# Altium schematic sheet GPS.SchDoc
size A4
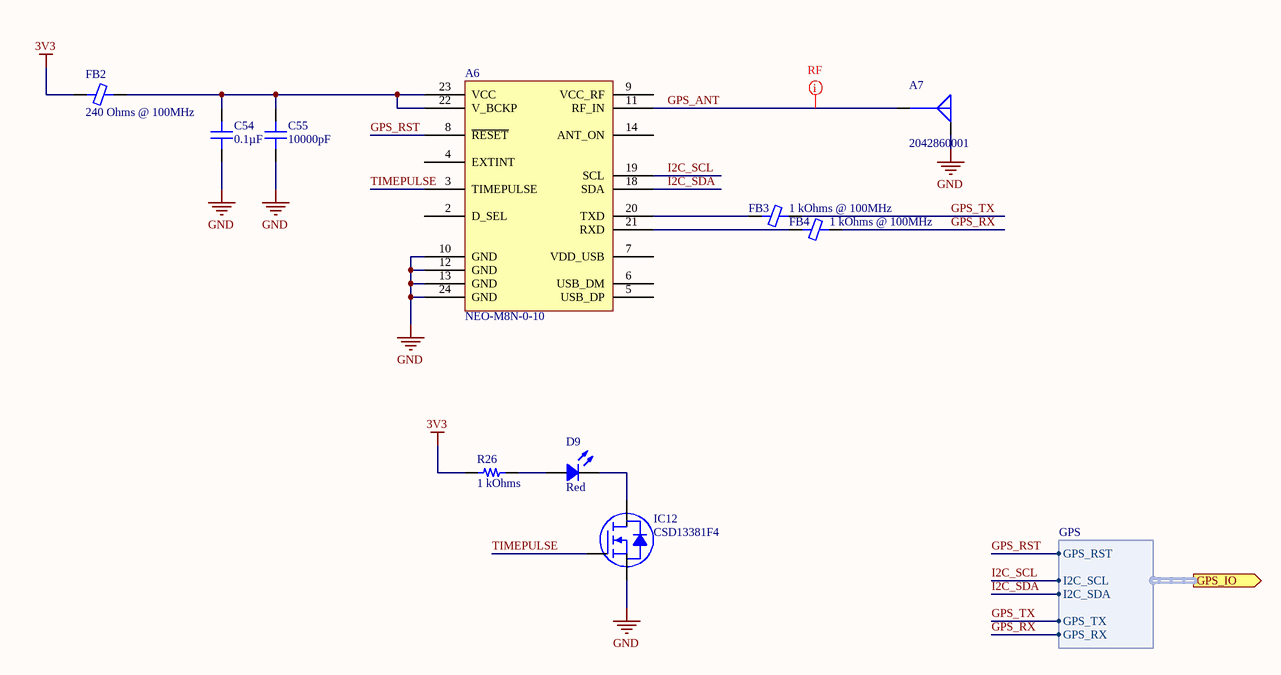
[diagram p0: GPS.SchDoc]

## Parts
A6  NEO-M8N-0-10  [U-BLOX NEO-M8N]
A7  2042860001  [MOLEX 2042860001]
C54  0.1µF  [CAP 0201_0603]
C55  10000pF  [CAP 0201_0603]
D9  Red  [LED 0402_1005 RED]
FB2  240 Ohms @ 100MHz  [FER 0201_0603]
FB3  1 kOhms @ 100MHz  [FER 0201_0603]
FB4  1 kOhms @ 100MHz  [FER 0201_0603]
IC12  CSD13381F4  [TI 3-XFDFN F4 YJC]
R26  1 kOhms  [RES 0201_0603]

## Ports
GPS_IO (out, harness GPS)

## Harnesses
GPS: I2C_SCL, I2C_SDA, GPS_TX, GPS_RX, GPS_RST

## Nets
3V3: FB2.1 R26.1
GND: A6.10(GND) A6.12(GND) A6.13(GND) A6.24(GND) A7.G C54.1 C55.1 IC12.S
GPS_ANT: A6.11(RF_IN) A7.S
GPS_RST: A6.8(~{RESET}) ; port GPS_IO.GPS_RST
GPS_RX: FB4.2 ; port GPS_IO.GPS_RX
GPS_TX: FB3.2 ; port GPS_IO.GPS_TX
I2C_SCL: A6.19(SCL) ; port GPS_IO.I2C_SCL
I2C_SDA: A6.18(SDA) ; port GPS_IO.I2C_SDA
TIMEPULSE: A6.3(TIMEPULSE) IC12.G
NetA6_20: A6.20(TXD) FB3.1
NetA6_21: A6.21(RXD) FB4.1
NetA6_22: A6.22(V_BCKP) A6.23(VCC) C54.2 C55.2 FB2.2
NetD9_1: D9.1 R26.2
NetD9_2: D9.2 IC12.D

Not connected (* = marked no-connect by the designer): A6 2(D_SEL) 4(EXTINT) 5(USB_DP) 6(USB_DM) 7(VDD_USB) 9(VCC_RF) 14(ANT_ON)

## Layout directives
net class RF: GPS_ANT

## Notes on the sheet
- Title
- Size:
- Date:
- A4
- Number:
- Time:
- Revision:
- Sheet
- of
- File:

## Library data of the parts
A6 = NEO-M8N-0-10: RF RCVR GNSS/GPS 1.575GHZ 24LCC; Manufacturer: U-Blox America Inc.; Current - Receiving: 21mA; Data Interface: I2C, SPI, UART, USB; Modulation or Protocol: BeiDou, Galileo, GLONASS, GNSS, GPS; Sensitivity: -167dBm; Voltage - Supply: 1.65V ~ 3.6V; Part Number: NEO-M8N-0-10; Applications: General Purpose; ComponentLink1Description: Datasheet; ComponentLink1URL: https://www.u-blox.com/sites/default/files/NEO-M8-FW3_DataSheet_%28UBX-15031086%29.pdf; ComponentLink2Description: DigiKey Link; ComponentLink2URL: http://digikey.com/product-detail/en/u-blox-america-inc/NEO-M8N-0-10/672-NEO-M8N-0-10CT-ND/6150671; Device Package: 24-SMD Module; Frequency: 1.575GHz; LastUpdated: 04/01/2020 00:19:34; Lifecycle Status: Active; Minimum Order: 1; Operating Temperature: -40°C ~ 85°C; Package / Case: 24-SMD Module; Packaging: ReReel; PartId: 3; Part Status: Active; Price: 0.00; Series: NEO-M8; Supplier 1: DigiKey; Supplier Part Number 1: 672-NEO-M8N-0-10CT-ND
A7 = 2042860001: RF ANT CER PATCH SOLDER SMD; Manufacturer: Molex; Antenna Type: Ceramic Patch; Frequency Group: UHF (1GHz ~ 2GHz); Gain: 5.5dBi; Number of Bands: 1; Return Loss: -10dB; RF Family/Standard: Navigation; Part Number: 2042860001; Applications: Beidou, GLONASS, GPS; ComponentLink1Description: Datasheet; ComponentLink1URL: http://www.literature.molex.com/SQLImages/kelmscott/Molex/PDF_Images/987651-5071.pdf; ComponentLink2Description: DigiKey Link; ComponentLink2URL: http://digikey.com/product-detail/en/molex/2042860001/WM16802-ND/7566910; Height (Max): 0.157" (4.00mm); LastUpdated: 12/12/2019 06:31:41; Lifecycle Status: 0; Minimum Order: 1; Mounting Type: Through Hole; Packaging: Tray; Part Status: Active; Price: 2.23; Series: *; Supplier 1: DigiKey; Supplier Part Number 1: WM16802-ND; Termination: Solder
C54 = GRM033R61C104ME84D: CAP CER 0.1UF 16V X5R 0201; Manufacturer: Murata Electronics; Tolerance: ±20%; Part Number: GRM033R61C104ME84D; Value: 0.1µF; Applications: General Purpose; Capacitance: 0.1µF; ComponentLink1Description: Datasheet; ComponentLink1URL: https://search.murata.co.jp/Ceramy/image/img/A01X/G101/ENG/GRM033R61C104ME84-01.pdf; ComponentLink2Description: DigiKey Link; ComponentLink2URL: http://digikey.com/product-detail/en/murata-electronics/GRM033R61C104ME84D/490-9986-1-ND/5026291; Device Package: 0201 (0603 Metric); LastUpdated: 21/01/2020 00:00:12; Lifecycle Status: Active; Minimum Order: 1; Mounting Type: Surface Mount, MLCC; Operating Temperature: -55°C ~ 85°C; Package / Case: 0201 (0603 Metric); Packaging: TapeAndReel; PartId: 1522; Part Status: Active; Price: 0.01; Series: GRM; Size / Dimension: 0.024" L x 0.012" W (0.60mm x 0.30mm); Supplier 1: DigiKey; Supplier Part Number 1: 490-9986-1-ND; Temperature Coefficient: X5R; Thickness (Max): 0.013" (0.33mm); Voltage - Rated: 16V
C55 = CGA1A2X7R0J103M030BA: CAP CER 10000PF 6.3V X7R 0201; Manufacturer: TDK Corporation; Tolerance: ±20%; Part Number: CGA1A2X7R0J103M030BA; Value: 10000pF; Applications: Automotive; Capacitance: 10000pF; ComponentLink1Description: Datasheet; ComponentLink1URL: https://product.tdk.com/info/en/catalog/datasheets/mlcc_automotive_general_en.pdf?ref_disty=digikey; ComponentLink2Description: DigiKey Link; ComponentLink2URL: http://digikey.com/product-detail/en/tdk-corporation/CGA1A2X7R0J103M030BA/445-12116-1-ND/3953782; Device Package: 0201 (0603 Metric); LastUpdated: 21/01/2020 00:00:11; Lifecycle Status: Active; Minimum Order: 1; Mounting Type: Surface Mount, MLCC; Operating Temperature: -55°C ~ 125°C; Package / Case: 0201 (0603 Metric); Packaging: TapeAndReel; PartId: 1683; Part Status: Active; Price: 0.01; Ratings: AEC-Q200; Series: CGA; Size / Dimension: 0.024" L x 0.012" W (0.60mm x 0.30mm); Supplier 1: DigiKey; Supplier Part Number 1: 445-12116-1-ND; Temperature Coefficient: X7R; Thickness (Max): 0.013" (0.33mm); Voltage - Rated: 6.3V
D9 = IN-S42ATR: LED RED CLEAR 0402 SMD; Manufacturer: Inolux; Configuration: Standard; Current - Test: 20mA; Lens Size: 0.60mm x 0.45mm; Lens Style: Rectangle with Flat Top; Millicandela Rating: 90mcd; Viewing Angle: 130°; Voltage - Forward (Vf) (Typ): 2.1V; Wavelength - Dominant: 631nm; Wavelength - Peak: 645nm; Part Number: IN-S42ATR; Color: Red; ComponentLink1Description: Datasheet; ComponentLink1URL: http://www.inolux-corp.com/datasheet/SMDLED/Mono%20Color%20Top%20View/IN-S42AT%20Series_V1.1.pdf; ComponentLink2Description: DigiKey Link; ComponentLink2URL: http://digikey.com/product-detail/en/inolux/IN-S42ATR/1830-1057-1-ND/7604692; Device Package: 0402 (1005 Metric); Height (Max): 0.55mm; LastUpdated: 21/01/2020 03:12:45; Lens Color: Clear; Lens Transparency: Clear; Lifecycle Status: Active; Minimum Order: 1; Mounting Type: Surface Mount; Package / Case: 0402 (1005 Metric); Packaging: TapeAndReel; PartId: 504; Part Status: Active; Price: 0.06; Series: IN-S42AT; Size / Dimension: 1.00mm L x 0.50mm W; Supplier 1: DigiKey; Supplier Part Number 1: 1830-1057-1-ND; Supplier Device Package: 0402; Value: Red
FB2 = BK0603TS241-T: FERRITE BEAD 240 OHM 0201 1LN; Manufacturer: Taiyo Yuden; Current Rating (Max): 400mA; DC Resistance (DCR) (Max): 320mOhm; Number of Lines: 1; Part Number: BK0603TS241-T; ComponentLink1Description: Datasheet; ComponentLink1URL: https://ds.yuden.co.jp/TYCOMPAS/ut/detail?pn=BK0603TS241-T  &u=M; ComponentLink2Description: DigiKey Link; ComponentLink2URL: http://digikey.com/product-detail/en/taiyo-yuden/BK0603TS241-T/587-3276-1-ND/4157923; Device Package: 0201 (0603 Metric); Height (Max): 0.013" (0.33mm); Impedance @ Frequency: 240 Ohms @ 100MHz; LastUpdated: 21/01/2020 02:24:59; Lifecycle Status: Active; Minimum Order: 1; Mounting Type: Surface Mount; Operating Temperature: -55°C ~ 125°C; Package / Case: 0201 (0603 Metric); Packaging: TapeAndReel; PartId: 40; Part Status: Active; Price: 0.03; Series: BK; Size / Dimension: 0.024" L x 0.012" W (0.60mm x 0.30mm); Supplier 1: DigiKey; Supplier Part Number 1: 587-3276-1-ND; Value: 240 Ohms @ 100MHz
FB3 FB4 = BK0603HR102-T: FERRITE BEAD 1 KOHM 0201 1LN; Manufacturer: Taiyo Yuden; Current Rating (Max): 220mA; DC Resistance (DCR) (Max): 1.15Ohm; Filter Type: Signal Line; Number of Lines: 1; Part Number: BK0603HR102-T; ComponentLink1Description: Datasheet; ComponentLink1URL: https://www.yuden.co.jp/productdata/catalog/mlci07_e.pdf; ComponentLink2Description: DigiKey Link; ComponentLink2URL: http://digikey.com/product-detail/en/taiyo-yuden/BK0603HR102-T/587-5408-1-ND/7067084; Device Package: 0201 (0603 Metric); Height (Max): 0.013" (0.33mm); Impedance @ Frequency: 1 kOhms @ 100MHz; LastUpdated: 21/01/2020 02:24:53; Lifecycle Status: Active; Minimum Order: 1; Mounting Type: Surface Mount; Operating Temperature: -55°C ~ 125°C; Package / Case: 0201 (0603 Metric); Packaging: CutTape; PartId: 137; Part Status: Active; Price: 0.10; Series: BK; Size / Dimension: 0.024" L x 0.012" W (0.60mm x 0.30mm); Supplier 1: DigiKey; Supplier Part Number 1: 587-5408-1-ND; Value: 1 kOhms @ 100MHz
IC12 = CSD13381F4: MOSFET N-CH 12V 2.1A 3PICOSTAR; Manufacturer: Texas Instruments; Current - Continuous Drain (Id) @ 25°C: 2.1A (Ta); Drive Voltage (Max Rds On,  Min Rds On): 1.8V, 4.5V; FET Type: N-Channel; Gate Charge (Qg) (Max) @ Vgs: 1.4nC @ 4.5V; Input Capacitance (Ciss) (Max) @ Vds: 200pF @ 6V; Power Dissipation (Max): 500mW (Ta); Rds On (Max) @ Id, Vgs: 180mOhm @ 500mA, 4.5V; Vgs (Max): 8V; Vgs(th) (Max) @ Id: 1.1V @ 250µA; Part Number: CSD13381F4; ComponentLink1Description: Datasheet; ComponentLink1URL: http://www.ti.com/general/docs/suppproductinfo.tsp?distId=10&gotoUrl=http%3A%2F%2Fwww.ti.com%2Flit%2Fgpn%2Fcsd13381f4; ComponentLink2Description: DigiKey Link; ComponentLink2URL: http://digikey.com/product-detail/en/texas-instruments/CSD13381F4/296-38912-1-ND/5143018; Device Package: 3-XFDFN; Drain to Source Voltage (Vdss): 12V; LastUpdated: 30/03/2020 15:00:54; Lifecycle Status: Active; Minimum Order: 1; Mounting Type: Surface Mount; Operating Temperature: -55°C ~ 150°C (TJ); Package / Case: 3-XFDFN; Packaging: TapeAndReel; Part Status: Active; Price: 0.07; Series: NexFET™; Supplier 1: DigiKey; Supplier Part Number 1: 296-38912-1-ND; Supplier Device Package: 3-PICOSTAR; Technology: MOSFET (Metal Oxide)
R26 = ERJ-1GNF1001C: RES SMD 1K OHM 1% 1/20W 0201; Manufacturer: Panasonic Electronic Components; Power (Watts): 0.05W, 1/20W; Temperature Coefficient: ±200ppm/°C; Part Number: ERJ-1GNF1001C; Value: 1 kOhms; ComponentLink1Description: Datasheet; ComponentLink1URL: https://industrial.panasonic.com/cdbs/www-data/pdf/RDA0000/AOA0000C304.pdf; ComponentLink2Description: DigiKey Link; ComponentLink2URL: http://digikey.com/product-detail/en/panasonic-electronic-components/ERJ-1GNF1001C/P122413CT-ND/7389439; Composition: Thick Film; Device Package: 0201 (0603 Metric); Features: Automotive AEC-Q200; Height - Seated (Max): 0.010" (0.26mm); LastUpdated: 21/01/2020 00:04:13; Lifecycle Status: Active; Minimum Order: 1; Number of Terminations: 2; Operating Temperature: -55°C ~ 125°C; Package / Case: 0201 (0603 Metric); Packaging: TapeAndReel; PartId: 2298; Part Status: Active; Price: 0.01; Ratings: AEC-Q200; Resistance: 1 kOhms; Series: ERJ; Size / Dimension: 0.024" L x 0.012" W (0.60mm x 0.30mm); Supplier 1: DigiKey; Supplier Part Number 1: P122413CT-ND; Supplier Device Package: 0201; Tolerance: ±1%